# Altium schematic sheet Mother Board STM32.SchDoc
size A4
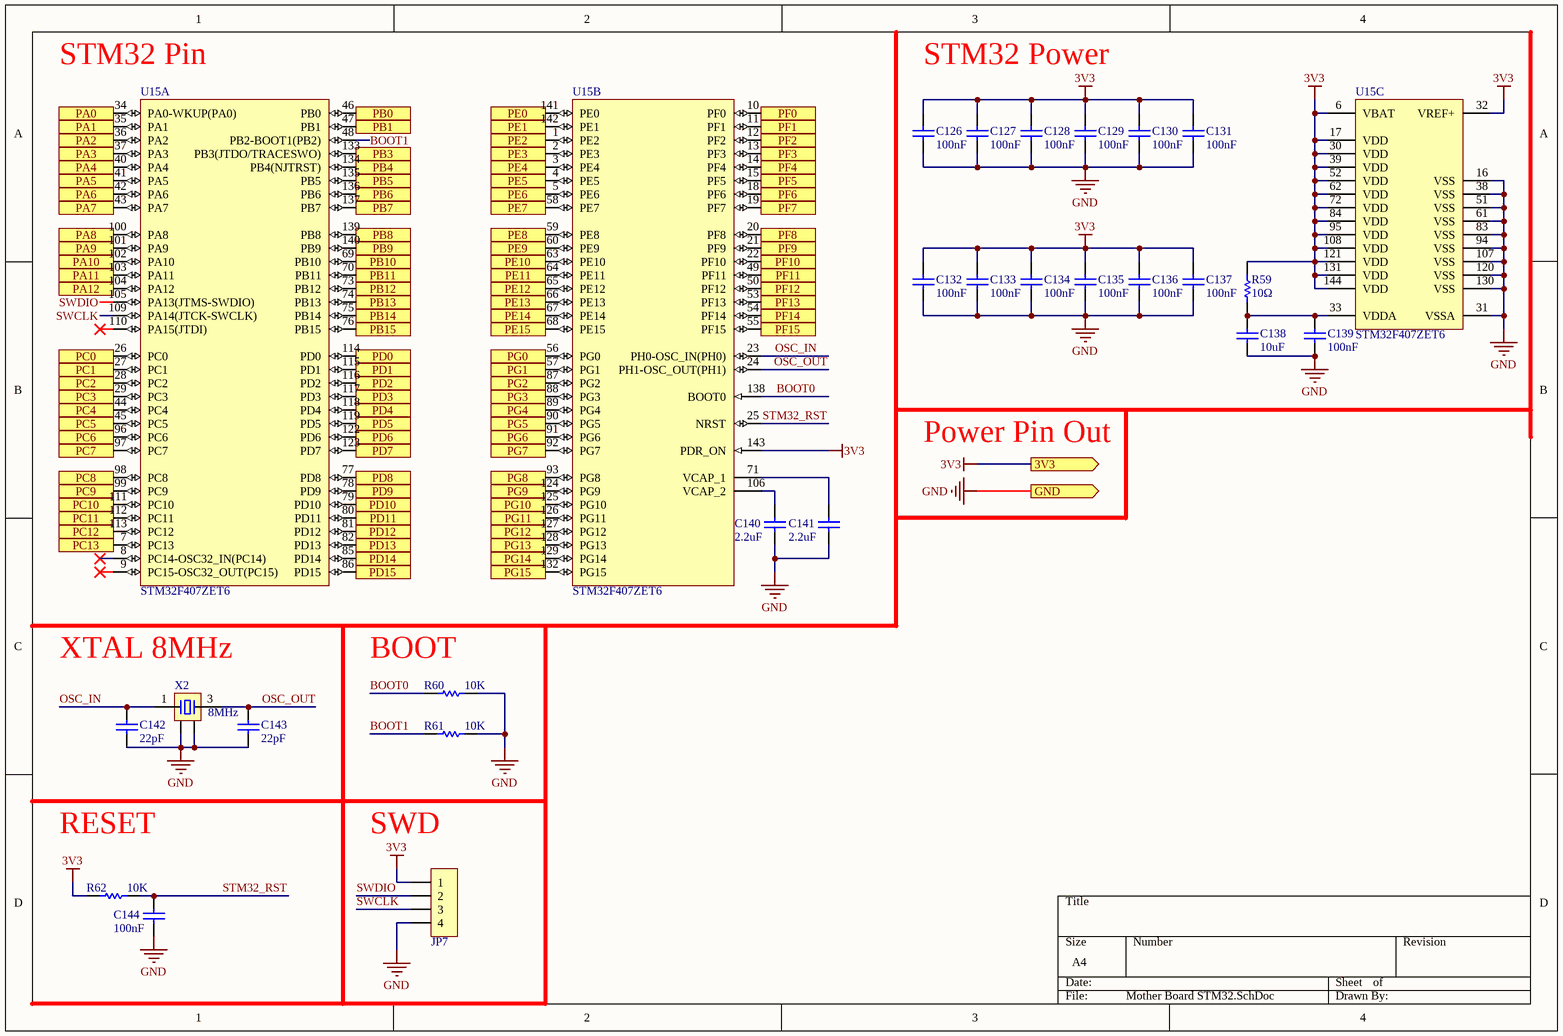
[diagram p0: Mother Board STM32.SchDoc]

## Parts
C126  100nF  [C0402]
C127  100nF  [C0402]
C128  100nF  [C0402]
C129  100nF  [C0402]
C130  100nF  [C0402]
C131  100nF  [C0402]
C132  100nF  [C0402]
C133  100nF  [C0402]
C134  100nF  [C0402]
C135  100nF  [C0402]
C136  100nF  [C0402]
C137  100nF  [C0402]
C138  10uF  [C0805]
C139  100nF  [C0402]
C140  2.2uF  [C0603]
C141  2.2uF  [C0603]
C142  22pF  [C0603]
C143  22pF  [C0603]
C144  100nF  [C0402]
JP7  HDR-1X4  [XH2.54-4P_H]  (value not drawn)
R59  10Ω  [R0402]
R60  10K  [R0402]
R61  10K  [R0402]
R62  10K  [R0402]
U15  STM32F407ZET6  [LQFP144 20X20_L]  (parts A,B,C of 3)
X2  8MHz  [XTAL-3225]

## Ports
3V3 (out), GND (out), PA0 (in), PA1 (in), PA2 (in), PA3 (in), PA4 (in), PA5 (in), PA6 (in), PA7 (in), PA8 (in), PA9 (in), PA10 (in), PA11 (in), PA12 (in), PB0 (in), PB1 (in), PB3 (in), PB4 (in), PB5 (in), PB6 (in), PB7 (in), PB8 (in), PB9 (in), PB10 (in), PB11 (in), PB12 (in), PB13 (in), PB14 (in), PB15 (in), PC0 (in), PC1 (in), PC2 (in), PC3 (in), PC4 (in), PC5 (in), PC6 (in), PC7 (in), PC8 (in), PC9 (in), PC10 (in), PC11 (in), PC12 (in), PC13 (in), PD0 (in), PD1 (in), PD2 (in), PD3 (in), PD4 (in), PD5 (in), PD6 (in), PD7 (in), PD8 (in), PD9 (in), PD10 (in), PD11 (in), PD12 (in), PD13 (in), PD14 (in), PD15 (in), PE0 (in), PE1 (in), PE2 (in), PE3 (in), PE4 (in), PE5 (in), PE6 (in), PE7 (in), PE8 (in), PE9 (in), PE10 (in), PE11 (in), PE12 (in), PE13 (in), PE14 (in), PE15 (in), PF0 (in), PF1 (in), PF2 (in), PF3 (in), PF4 (in), PF5 (in), PF6 (in), PF7 (in), PF8 (in), PF9 (in), PF10 (in), PF11 (in), PF12 (in), PF13 (in), PF14 (in), PF15 (in), PG0 (in), PG1 (in), PG2 (in), PG3 (in), PG4 (in), PG5 (in), PG6 (in), PG7 (in), PG8 (in), PG9 (in), PG10 (in), PG11 (in), PG12 (in), PG13 (in), PG14 (in), PG15 (in)

## Nets
3V3: C126.1 C127.1 C128.1 C129.1 C130.1 C131.1 C132.1 C133.1 C134.1 C135.1 C136.1 C137.1 JP7.1 R59.2 R62.1 U15.6(VBAT) U15.17(VDD) U15.30(VDD) U15.32(VREF+) U15.39(VDD) U15.52(VDD) U15.62(VDD) U15.72(VDD) U15.84(VDD) U15.95(VDD) U15.108(VDD) U15.121(VDD) U15.131(VDD) U15.143(PDR_ON) U15.144(VDD) ; port 3V3
GND: C126.2 C127.2 C128.2 C129.2 C130.2 C131.2 C132.2 C133.2 C134.2 C135.2 C136.2 C137.2 C138.2 C139.2 C140.1 C141.1 C142.1 C143.1 C144.1 JP7.4 R60.2 R61.2 U15.16(VSS) U15.31(VSSA) U15.38(VSS) U15.51(VSS) U15.61(VSS) U15.83(VSS) U15.94(VSS) U15.107(VSS) U15.120(VSS) U15.130(VSS) X2.2 X2.4 ; port GND
BOOT0: R60.1 U15.138(BOOT0)
BOOT1: R61.1 U15.48(PB2-BOOT1(PB2))
OSC_IN: C142.2 U15.23(PH0-OSC_IN(PH0)) X2.1
OSC_OUT: C143.2 U15.24(PH1-OSC_OUT(PH1)) X2.3
PA0: U15.34(PA0-WKUP(PA0)) ; port PA0
PA1: U15.35(PA1) ; port PA1
PA2: U15.36(PA2) ; port PA2
PA3: U15.37(PA3) ; port PA3
PA4: U15.40(PA4) ; port PA4
PA5: U15.41(PA5) ; port PA5
PA6: U15.42(PA6) ; port PA6
PA7: U15.43(PA7) ; port PA7
PA8: U15.100(PA8) ; port PA8
PA9: U15.101(PA9) ; port PA9
PA10: U15.102(PA10) ; port PA10
PA11: U15.103(PA11) ; port PA11
PA12: U15.104(PA12) ; port PA12
PB0: U15.46(PB0) ; port PB0
PB1: U15.47(PB1) ; port PB1
PB3: U15.133(PB3(JTDO/TRACESWO)) ; port PB3
PB4: U15.134(PB4(NJTRST)) ; port PB4
PB5: U15.135(PB5) ; port PB5
PB6: U15.136(PB6) ; port PB6
PB7: U15.137(PB7) ; port PB7
PB8: U15.139(PB8) ; port PB8
PB9: U15.140(PB9) ; port PB9
PB10: U15.69(PB10) ; port PB10
PB11: U15.70(PB11) ; port PB11
PB12: U15.73(PB12) ; port PB12
PB13: U15.74(PB13) ; port PB13
PB14: U15.75(PB14) ; port PB14
PB15: U15.76(PB15) ; port PB15
PC0: U15.26(PC0) ; port PC0
PC1: U15.27(PC1) ; port PC1
PC2: U15.28(PC2) ; port PC2
PC3: U15.29(PC3) ; port PC3
PC4: U15.44(PC4) ; port PC4
PC5: U15.45(PC5) ; port PC5
PC6: U15.96(PC6) ; port PC6
PC7: U15.97(PC7) ; port PC7
PC8: U15.98(PC8) ; port PC8
PC9: U15.99(PC9) ; port PC9
PC10: U15.111(PC10) ; port PC10
PC11: U15.112(PC11) ; port PC11
PC12: U15.113(PC12) ; port PC12
PC13: U15.7(PC13) ; port PC13
PD0: U15.114(PD0) ; port PD0
PD1: U15.115(PD1) ; port PD1
PD2: U15.116(PD2) ; port PD2
PD3: U15.117(PD3) ; port PD3
PD4: U15.118(PD4) ; port PD4
PD5: U15.119(PD5) ; port PD5
PD6: U15.122(PD6) ; port PD6
PD7: U15.123(PD7) ; port PD7
PD8: U15.77(PD8) ; port PD8
PD9: U15.78(PD9) ; port PD9
PD10: U15.79(PD10) ; port PD10
PD11: U15.80(PD11) ; port PD11
PD12: U15.81(PD12) ; port PD12
PD13: U15.82(PD13) ; port PD13
PD14: U15.85(PD14) ; port PD14
PD15: U15.86(PD15) ; port PD15
PE0: U15.141(PE0) ; port PE0
PE1: U15.142(PE1) ; port PE1
PE2: U15.1(PE2) ; port PE2
PE3: U15.2(PE3) ; port PE3
PE4: U15.3(PE4) ; port PE4
PE5: U15.4(PE5) ; port PE5
PE6: U15.5(PE6) ; port PE6
PE7: U15.58(PE7) ; port PE7
PE8: U15.59(PE8) ; port PE8
PE9: U15.60(PE9) ; port PE9
PE10: U15.63(PE10) ; port PE10
PE11: U15.64(PE11) ; port PE11
PE12: U15.65(PE12) ; port PE12
PE13: U15.66(PE13) ; port PE13
PE14: U15.67(PE14) ; port PE14
PE15: U15.68(PE15) ; port PE15
PF0: U15.10(PF0) ; port PF0
PF1: U15.11(PF1) ; port PF1
PF2: U15.12(PF2) ; port PF2
PF3: U15.13(PF3) ; port PF3
PF4: U15.14(PF4) ; port PF4
PF5: U15.15(PF5) ; port PF5
PF6: U15.18(PF6) ; port PF6
PF7: U15.19(PF7) ; port PF7
PF8: U15.20(PF8) ; port PF8
PF9: U15.21(PF9) ; port PF9
PF10: U15.22(PF10) ; port PF10
PF11: U15.49(PF11) ; port PF11
PF12: U15.50(PF12) ; port PF12
PF13: U15.53(PF13) ; port PF13
PF14: U15.54(PF14) ; port PF14
PF15: U15.55(PF15) ; port PF15
PG0: U15.56(PG0) ; port PG0
PG1: U15.57(PG1) ; port PG1
PG2: U15.87(PG2) ; port PG2
PG3: U15.88(PG3) ; port PG3
PG4: U15.89(PG4) ; port PG4
PG5: U15.90(PG5) ; port PG5
PG6: U15.91(PG6) ; port PG6
PG7: U15.92(PG7) ; port PG7
PG8: U15.93(PG8) ; port PG8
PG9: U15.124(PG9) ; port PG9
PG10: U15.125(PG10) ; port PG10
PG11: U15.126(PG11) ; port PG11
PG12: U15.127(PG12) ; port PG12
PG13: U15.128(PG13) ; port PG13
PG14: U15.129(PG14) ; port PG14
PG15: U15.132(PG15) ; port PG15
STM32_RST: C144.2 R62.2 U15.25(NRST)
SWCLK: JP7.3 U15.109(PA14(JTCK-SWCLK))
SWDIO: JP7.2 U15.105(PA13(JTMS-SWDIO))
NetC138_1: C138.1 C139.1 R59.1 U15.33(VDDA)
NetC140_2: C140.2 U15.106(VCAP_2)
NetC141_2: C141.2 U15.71(VCAP_1)

Not connected (* = marked no-connect by the designer): U15 8(PC14-OSC32_IN(PC14))* 9(PC15-OSC32_OUT(PC15))* 110(PA15(JTDI))*

## Notes on the sheet
- (near U15) STM32 Pin
- STM32 Power
- Power Pin Out
- XTAL 8MHz
- (near R60) BOOT
- RESET
- (near JP7) SWD

## Library data of the parts
C126-C144 = Cap
JP7 = Header 4P: 4P接插件; 版权归属: 源创客; BOM名称: 4P接插件; 学习资源: www.ooocke.com
R59-R62 = RES
U15 = STM32F407ZET6: ARM Cortex-M4 32-bit MCU+FPU, 210 DMIPS, 512 kB Flash, 192 kB Internal RAM, 114 I/Os, 144-pin LQFP, -40 to 85 degC, Tray; Manufacturer: STMicroelectronics; D/A Converter: 2x12-bit; FLASH Size (Prog) (kB): 512; I/Os (High Current): 114; Internal RAM Size (kB): 192; Operating Frequency(F) (Processor speed) (MHz): 168; Supply Voltage(Vcc) max (V): 3.6; Supply Voltage(Vcc) min (V): 1.8; DatasheetVersion: Rev. 4; PackageVersion: Rev. 4, 06/2013; PackageReference: LQFP144; PackageDescription: 144-Pin Low Profile Quad Flat Package, 20 x 20 mm Body, 0.5 mm Pitch; Supplier 1: Digi-Key; Supplier Part Number 1: 497-11903-ND; Supplier 2: Farnell; Supplier Part Number 2: 2215229; Supplier 3: Newark; Supplier Part Number 3: 46W2203; Supplier 4: Newark; Supplier Part Number 4: 87T3795; Supplier 5: Mouser; Supplier Part Number 5: 511-STM32F407ZET6; Core: ARM Cortex-M4; Packing: Tray; Mounting Technology: Surface Mount; PartNumber: STM32F407ZET6; ComponentLink1Description: Manufacturer URL; ComponentLink1URL: http://www.st.com/web/en/home.html; ComponentLink2Description: Datasheet; ComponentLink2URL: http://www.st.com/st-web-ui/static/active/en/resource/technical/document/datasheet/DM00037051.pdf; ComponentLink3Description: Package Specification; ComponentLink3URL: http://www.st.com/st-web-ui/static/active/en/resource/technical/document/datasheet/DM00037051.pdf
X2 = XTAL-4: 4脚晶振; 版权归属: 源创客; BOM名称: 4脚晶振; 学习资源: www.ooocke.com